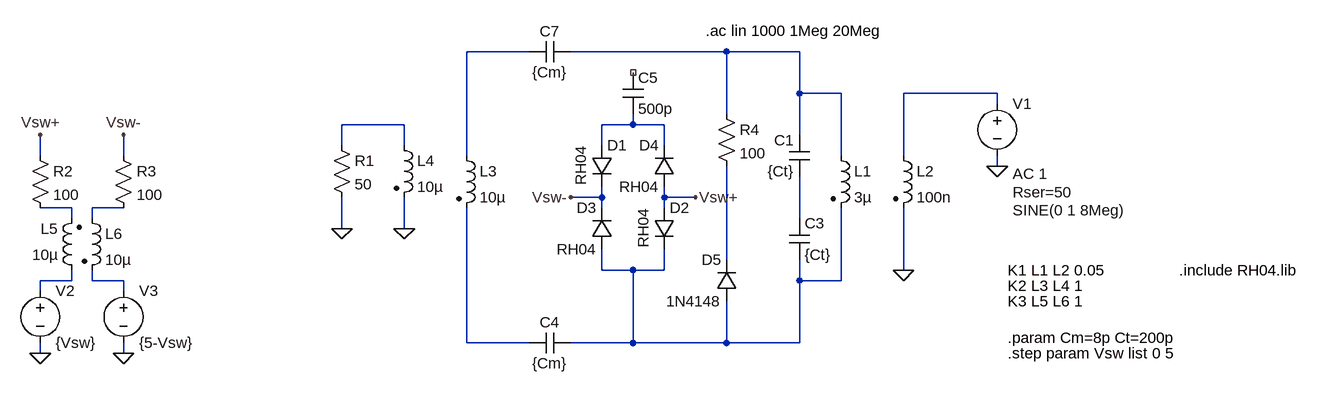
[diagram p0: schematic switching_sim.asc]
switching_sim.asc, the LTspice schematic file:
Version 4
SHEET 1 1080 984
WIRE -176 80 -272 80
WIRE 128 80 -112 80
WIRE 240 80 128 80
WIRE 240 144 240 80
WIRE 304 144 240 144
WIRE 544 144 400 144
WIRE 544 160 544 144
WIRE 128 176 128 80
WIRE -368 192 -464 192
WIRE -16 192 -16 176
WIRE -16 192 -64 192
WIRE 32 192 -16 192
WIRE 240 208 240 144
WIRE -464 224 -464 192
WIRE -368 224 -368 192
WIRE -64 224 -64 192
WIRE 32 224 32 192
WIRE -928 240 -928 208
WIRE -800 240 -800 208
WIRE -272 240 -272 80
WIRE 304 240 304 144
WIRE 400 240 400 144
WIRE 544 256 544 240
WIRE -64 304 -64 288
WIRE -64 304 -112 304
WIRE 32 304 32 288
WIRE 80 304 32 304
WIRE -880 320 -928 320
WIRE -800 320 -848 320
WIRE -64 320 -64 304
WIRE 32 320 32 304
WIRE -880 336 -880 320
WIRE -848 336 -848 320
WIRE 240 336 240 272
WIRE -464 352 -464 304
WIRE -368 352 -368 304
WIRE 128 400 128 256
WIRE -64 416 -64 384
WIRE -16 416 -64 416
WIRE 32 416 32 384
WIRE 32 416 -16 416
WIRE 400 416 400 320
WIRE -880 432 -880 416
WIRE -880 432 -928 432
WIRE -848 432 -848 416
WIRE -800 432 -848 432
WIRE 240 432 240 400
WIRE 304 432 304 320
WIRE 304 432 240 432
WIRE -928 448 -928 432
WIRE -800 448 -800 432
WIRE -272 528 -272 320
WIRE -176 528 -272 528
WIRE -16 528 -16 416
WIRE -16 528 -112 528
WIRE 128 528 128 464
WIRE 128 528 -16 528
WIRE 240 528 240 432
WIRE 240 528 128 528
WIRE -928 544 -928 528
WIRE -800 544 -800 528
FLAG 544 256 0
FLAG 400 416 0
FLAG -368 352 0
FLAG -464 352 0
FLAG -800 544 0
FLAG -928 544 0
FLAG -928 208 Vsw+
FLAG -800 208 Vsw-
FLAG -112 304 Vsw-
FLAG 80 304 Vsw+
SYMBOL ind2 288 224 R0
SYMATTR InstName L1
SYMATTR Value 3µ
SYMATTR Type ind
SYMATTR SpiceLine Rser=0.001
SYMBOL cap 256 272 R180
WINDOW 0 24 56 Left 2
WINDOW 3 24 8 Left 2
SYMATTR InstName C1
SYMATTR Value {Ct}
SYMBOL voltage 544 144 R0
WINDOW 3 24 180 Left 2
WINDOW 123 24 124 Left 2
WINDOW 39 24 152 Left 2
SYMATTR Value SINE(0 1 8Meg)
SYMATTR Value2 AC 1
SYMATTR SpiceLine Rser=50
SYMATTR InstName V1
SYMBOL ind2 384 224 R0
SYMATTR InstName L2
SYMATTR Value 100n
SYMATTR Type ind
SYMBOL ind2 -288 224 R0
SYMATTR InstName L3
SYMATTR Value 10µ
SYMATTR Type ind
SYMBOL ind2 -384 208 R0
SYMATTR InstName L4
SYMATTR Value 10µ
SYMATTR Type ind
SYMBOL res -480 208 R0
SYMATTR InstName R1
SYMATTR Value 50
SYMBOL cap 224 336 R0
SYMATTR InstName C3
SYMATTR Value {Ct}
SYMBOL cap -112 512 R90
WINDOW 0 0 32 VBottom 2
WINDOW 3 32 32 VTop 2
SYMATTR InstName C4
SYMATTR Value {Cm}
SYMBOL cap -32 112 R0
SYMATTR InstName C5
SYMATTR Value 500p
SYMBOL voltage -928 432 R0
WINDOW 123 0 0 Left 0
WINDOW 39 0 0 Left 0
SYMATTR InstName V2
SYMATTR Value {Vsw}
SYMBOL res -944 224 R0
SYMATTR InstName R2
SYMATTR Value 100
SYMBOL res -816 224 R0
SYMATTR InstName R3
SYMATTR Value 100
SYMBOL ind2 -864 432 R180
WINDOW 0 36 80 Left 2
WINDOW 3 36 40 Left 2
SYMATTR InstName L5
SYMATTR Value 10µ
SYMATTR Type ind
SYMBOL ind2 -864 320 R0
SYMATTR InstName L6
SYMATTR Value 10µ
SYMATTR Type ind
SYMBOL voltage -800 432 R0
WINDOW 123 0 0 Left 0
WINDOW 39 0 0 Left 0
SYMATTR InstName V3
SYMATTR Value {5-Vsw}
SYMBOL diode -80 224 R0
WINDOW 3 -16 1 VRight 2
SYMATTR Value RH04
SYMATTR InstName D1
SYMBOL cap -112 64 R90
WINDOW 0 0 32 VBottom 2
WINDOW 3 32 32 VTop 2
SYMATTR InstName C7
SYMATTR Value {Cm}
SYMBOL diode 16 320 R0
WINDOW 3 -16 1 VRight 2
SYMATTR Value RH04
SYMATTR InstName D2
SYMBOL diode -48 384 R180
WINDOW 0 24 64 Left 2
WINDOW 3 24 0 Left 2
SYMATTR InstName D3
SYMATTR Value RH04
SYMBOL diode 48 288 R180
WINDOW 0 24 64 Left 2
WINDOW 3 24 0 Left 2
SYMATTR InstName D4
SYMATTR Value RH04
SYMBOL diode 144 464 R180
WINDOW 0 24 64 Left 2
WINDOW 3 24 0 Left 2
SYMATTR InstName D5
SYMATTR Value 1N4148
SYMBOL res 112 160 R0
SYMATTR InstName R4
SYMATTR Value 100
TEXT 96 48 Left 2 !.ac lin 1000 1Meg 20Meg
TEXT 560 416 Left 2 !K1 L1 L2 0.05
TEXT 560 440 Left 2 !K2 L3 L4 1
TEXT 560 520 Left 2 !.param Cm=8p Ct=200p
TEXT 824 416 Left 2 !.include RH04.lib
TEXT 560 544 Left 2 !.step param Vsw list 0 5
TEXT 560 464 Left 2 !K3 L5 L6 1

The netlist it stands for:
* switching_sim.asc
L1 N002 N010 3µ Rser=0.001
C1 N008 N002 {Ct}
V1 N003 0 SINE(0 1 8Meg) AC 1 Rser=50
L2 N003 0 100n
L3 N001 N013 10µ
L4 N004 0 10µ
R1 N004 0 50
C3 N008 N010 {Ct}
C4 N010 N013 {Cm}
C5 NC_01 N005 500p
V2 N011 0 {Vsw}
R2 Vsw+ N006 100
R3 Vsw- N007 100
L5 N011 N006 10µ
L6 N007 N012 10µ
V3 N012 0 {5-Vsw}
D1 N005 Vsw- RH04
C7 N002 N001 {Cm}
D2 Vsw+ N010 RH04
D3 N010 Vsw- RH04
D4 Vsw+ N005 RH04
D5 N010 N009 1N4148
R4 N002 N009 100
.model D D
.lib standard.dio
.ac lin 1000 1Meg 20Meg
K1 L1 L2 0.05
K2 L3 L4 1
.param Cm=8p Ct=200p
.include RH04.lib
.step param Vsw list 0 5
K3 L5 L6 1
.backanno
.end